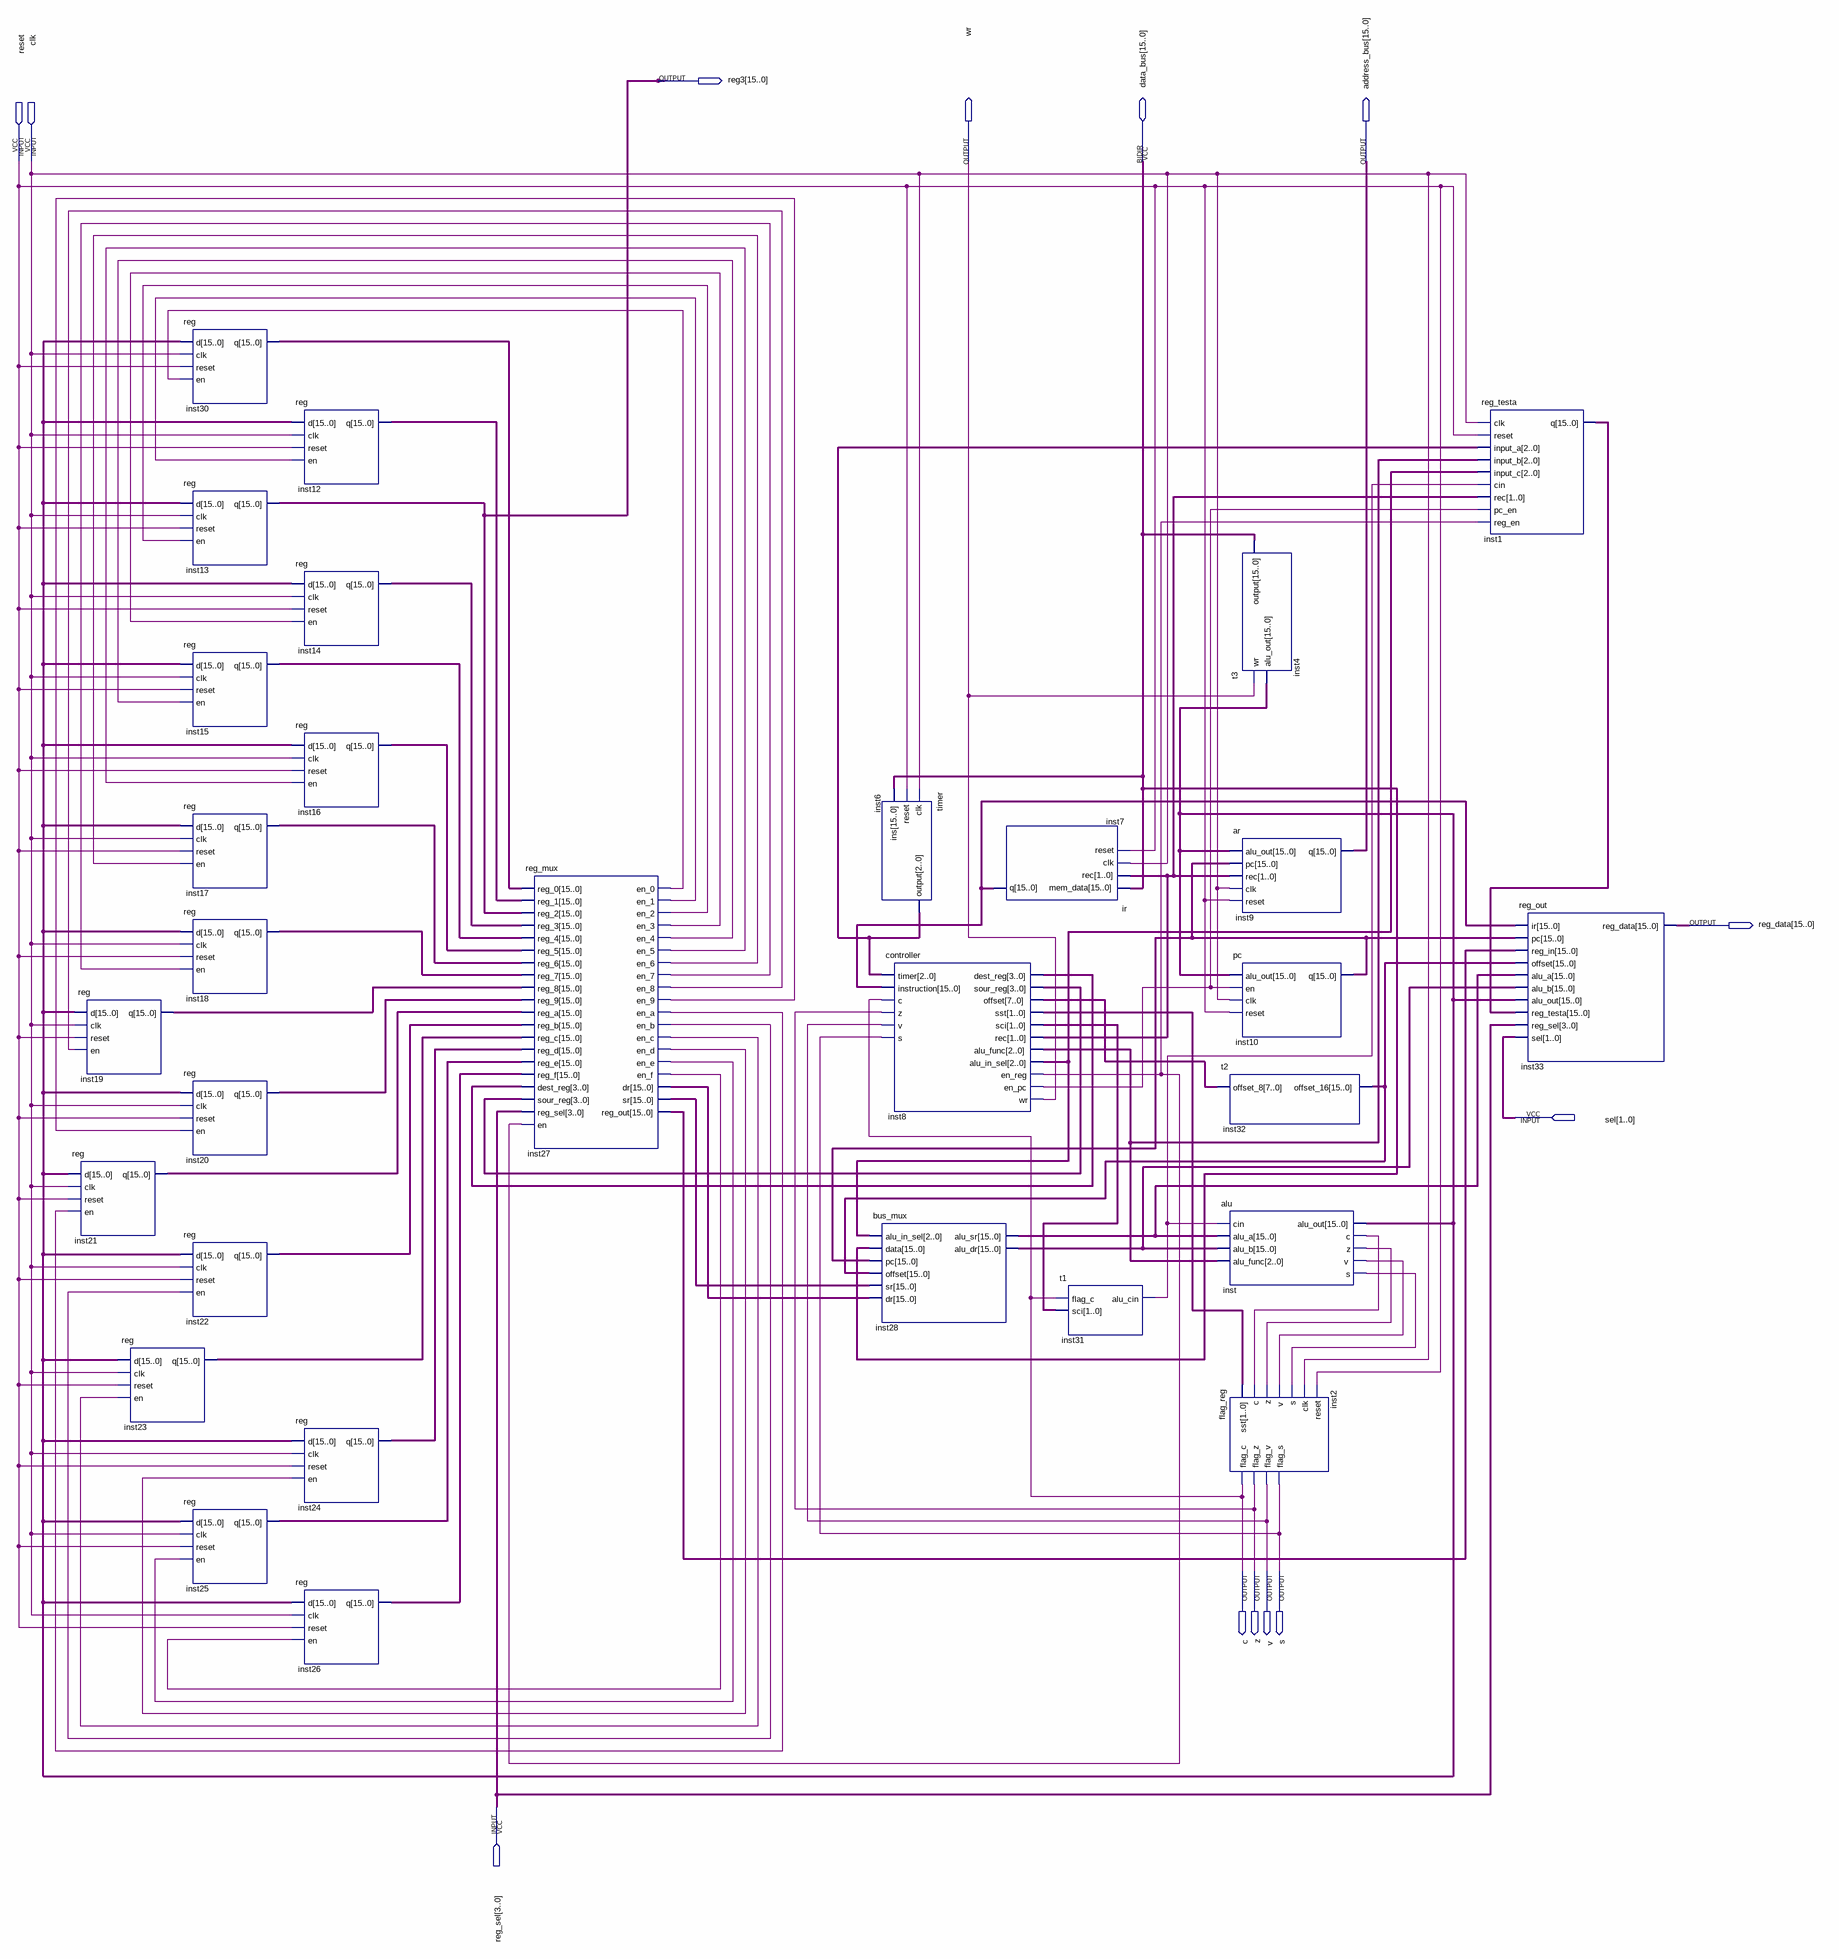
[diagram p0: schematic sheet]
// Quartus schematic cpu0.bdf as structural Verilog: 30 symbols, 13 pins
module cpu0 (
  input  reset,
  input  clk,
  input  [1:0] sel,
  input  [3:0] reg_sel,
  inout  [15:0] data_bus,
  output [15:0] reg3,
  output wr,
  output [15:0] address_bus,
  output [15:0] reg_data,
  output c,
  output z,
  output v,
  output s
);

  wire inst8_en_pc, inst8_en_reg, inst27_en_0, inst27_en_1, inst27_en_2, inst27_en_3, inst27_en_4,
       inst27_en_5, inst27_en_6, inst27_en_7, inst27_en_8, inst27_en_9, inst27_en_a, inst27_en_b,
       inst27_en_c, inst27_en_d, inst27_en_e, inst27_en_f, inst31_alu_cin, inst_c, inst_s, inst_v, inst_z;
  wire [1:0] inst8_rec, inst8_sci, inst8_sst;
  wire [2:0] inst6_output, inst8_alu_func, inst8_alu_in_sel;
  wire [3:0] inst8_dest_reg, inst8_sour_reg;
  wire [7:0] inst8_offset;
  wire [15:0] inst1_q, inst7_q, inst10_q, inst12_q, inst14_q, inst15_q, inst16_q, inst17_q, inst18_q,
       inst19_q, inst20_q, inst21_q, inst22_q, inst23_q, inst24_q, inst25_q, inst26_q, inst27_dr,
       inst27_reg_out, inst27_sr, inst28_alu_dr, inst28_alu_sr, inst30_q, inst32_offset_16, inst_alu_out;

  \reg  inst19 (.d(inst_alu_out), .clk(clk), .reset(reset), .en(inst27_en_8), .q(inst19_q));
  \reg  inst21 (.d(inst_alu_out), .clk(clk), .reset(reset), .en(inst27_en_a), .q(inst21_q));
  \reg  inst23 (.d(inst_alu_out), .clk(clk), .reset(reset), .en(inst27_en_c), .q(inst23_q));
  \reg  inst30 (.d(inst_alu_out), .clk(clk), .reset(reset), .en(inst27_en_0), .q(inst30_q));
  \reg  inst13 (.d(inst_alu_out), .clk(clk), .reset(reset), .en(inst27_en_2), .q(reg3));
  \reg  inst15 (.d(inst_alu_out), .clk(clk), .reset(reset), .en(inst27_en_4), .q(inst15_q));
  \reg  inst17 (.d(inst_alu_out), .clk(clk), .reset(reset), .en(inst27_en_6), .q(inst17_q));
  \reg  inst18 (.d(inst_alu_out), .clk(clk), .reset(reset), .en(inst27_en_7), .q(inst18_q));
  \reg  inst20 (.d(inst_alu_out), .clk(clk), .reset(reset), .en(inst27_en_9), .q(inst20_q));
  \reg  inst22 (.d(inst_alu_out), .clk(clk), .reset(reset), .en(inst27_en_b), .q(inst22_q));
  \reg  inst25 (.d(inst_alu_out), .clk(clk), .reset(reset), .en(inst27_en_e), .q(inst25_q));
  \reg  inst12 (.d(inst_alu_out), .clk(clk), .reset(reset), .en(inst27_en_1), .q(inst12_q));
  \reg  inst14 (.d(inst_alu_out), .clk(clk), .reset(reset), .en(inst27_en_3), .q(inst14_q));
  \reg  inst16 (.d(inst_alu_out), .clk(clk), .reset(reset), .en(inst27_en_5), .q(inst16_q));
  \reg  inst24 (.d(inst_alu_out), .clk(clk), .reset(reset), .en(inst27_en_d), .q(inst24_q));
  \reg  inst26 (.d(inst_alu_out), .clk(clk), .reset(reset), .en(inst27_en_f), .q(inst26_q));
  reg_mux inst27 (
    .reg_0(inst30_q), .reg_1(inst12_q), .reg_2(reg3), .reg_3(inst14_q), .reg_4(inst15_q), .reg_5(inst16_q),
    .reg_6(inst17_q), .reg_7(inst18_q), .reg_8(inst19_q), .reg_9(inst20_q), .reg_a(inst21_q),
    .reg_b(inst22_q), .reg_c(inst23_q), .reg_d(inst24_q), .reg_e(inst25_q), .reg_f(inst26_q),
    .dest_reg(inst8_dest_reg), .sour_reg(inst8_sour_reg), .reg_sel(reg_sel), .en(inst8_en_reg),
    .en_0(inst27_en_0), .en_1(inst27_en_1), .en_2(inst27_en_2), .en_3(inst27_en_3), .en_4(inst27_en_4),
    .en_5(inst27_en_5), .en_6(inst27_en_6), .en_7(inst27_en_7), .en_8(inst27_en_8), .en_9(inst27_en_9),
    .en_a(inst27_en_a), .en_b(inst27_en_b), .en_c(inst27_en_c), .en_d(inst27_en_d), .en_e(inst27_en_e),
    .en_f(inst27_en_f), .dr(inst27_dr), .sr(inst27_sr), .reg_out(inst27_reg_out));
  timer inst6 (.clk(clk), .reset(reset), .ins(data_bus), .\output (inst6_output));
  controller inst8 (
    .timer(inst6_output), .instruction(inst7_q), .c(c), .z(z), .v(v), .s(s), .dest_reg(inst8_dest_reg),
    .sour_reg(inst8_sour_reg), .offset(inst8_offset), .sst(inst8_sst), .sci(inst8_sci), .rec(inst8_rec),
    .alu_func(inst8_alu_func), .alu_in_sel(inst8_alu_in_sel), .en_reg(inst8_en_reg), .en_pc(inst8_en_pc),
    .wr(wr));
  bus_mux inst28 (
    .alu_in_sel(inst8_alu_in_sel), .data(data_bus), .pc(inst10_q), .offset(inst32_offset_16), .sr(inst27_sr),
    .dr(inst27_dr), .alu_sr(inst28_alu_sr), .alu_dr(inst28_alu_dr));
  ir inst7 (.mem_data(data_bus), .rec(inst8_rec), .clk(clk), .reset(reset), .q(inst7_q));
  t1 inst31 (.flag_c(c), .sci(inst8_sci), .alu_cin(inst31_alu_cin));
  t3 inst4 (.wr(wr), .alu_out(inst_alu_out), .\output (data_bus));
  ar inst9 (.alu_out(inst_alu_out), .pc(inst10_q), .rec(inst8_rec), .clk(clk), .reset(reset), .q(address_bus));
  pc inst10 (.alu_out(inst_alu_out), .en(inst8_en_pc), .clk(clk), .reset(reset), .q(inst10_q));
  t2 inst32 (.offset_8(inst8_offset), .offset_16(inst32_offset_16));
  alu inst (
    .cin(inst31_alu_cin), .alu_a(inst28_alu_sr), .alu_b(inst28_alu_dr), .alu_func(inst8_alu_func),
    .alu_out(inst_alu_out), .c(inst_c), .z(inst_z), .v(inst_v), .s(inst_s));
  flag_reg inst2 (
    .sst(inst8_sst), .c(inst_c), .z(inst_z), .v(inst_v), .s(inst_s), .clk(clk), .reset(reset), .flag_c(c),
    .flag_z(z), .flag_v(v), .flag_s(s));
  reg_testa inst1 (
    .clk(clk), .reset(reset), .input_a(inst6_output), .input_b(inst8_alu_func), .input_c(inst8_alu_in_sel),
    .cin(inst31_alu_cin), .rec(inst8_rec), .pc_en(inst8_en_pc), .reg_en(inst8_en_reg), .q(inst1_q));
  reg_out inst33 (
    .ir(inst7_q), .pc(inst10_q), .reg_in(inst27_reg_out), .offset(inst32_offset_16), .alu_a(inst28_alu_sr),
    .alu_b(inst28_alu_dr), .alu_out(inst_alu_out), .reg_testa(inst1_q), .reg_sel(reg_sel), .sel(sel),
    .reg_data(reg_data));
endmodule
